# Altium schematic sheet Top.SchDoc
size A4; SheetNumber: 1; SheetTotal: 3
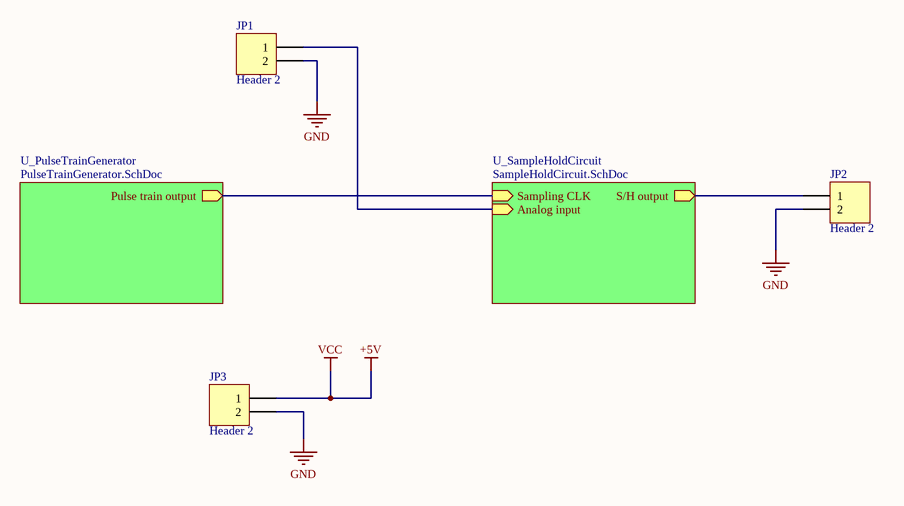
[diagram p0: Top.SchDoc]

## Parts
JP1  Header 2  [HDR1X2]
JP2  Header 2  [HDR1X2]
JP3  Header 2  [HDR1X2]

## Sub-sheets
U_PulseTrainGenerator = PulseTrainGenerator.SchDoc: Pulse train output (out)
U_SampleHoldCircuit = SampleHoldCircuit.SchDoc: Sampling CLK (in), Analog input (in), S/H output (out)

## Nets
+5V: JP3.1  [also labelled VCC]
GND: JP1.2 JP2.2 JP3.2
NetJP1_1: JP1.1 ; sheet U_SampleHoldCircuit/Analog input
NetJP2_1: JP2.1 ; sheet U_SampleHoldCircuit/S/H output
(unnamed): sheet U_SampleHoldCircuit/Sampling CLK, sheet U_PulseTrainGenerator/Pulse train output

## Library data of the parts
JP1-JP3 = Header 2: Header, 2-Pin; Revision: 17-Jul-2002: Re-released for DXP Platform.; Publisher: Altium Limited